# Altium project RouterBatteryLED.PrjPCB
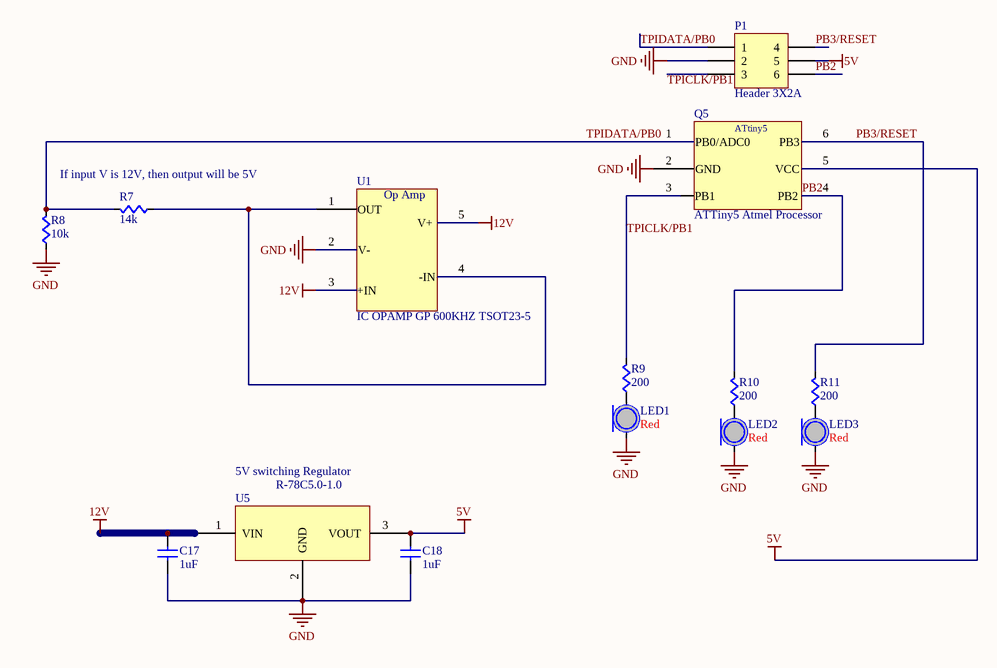
[diagram p0: RouterBatteryLED.SchDoc]
3 sheets, 56 parts. Net scope: global (net labels, ports and power ports of the same name join across sheets).
Board files: Router3.PcbDoc, RouterFinal.PcbDoc
Sheets:
  RouterBatteryLED.SchDoc
  Batteries.SchDoc
  Switching_Regulator.SchDoc

## Sheet RouterBatteryLED.SchDoc
size A

### Parts
C17  value 1uF  [CAPC0603]  (hidden comment: Cap)
C18  value 1uF  [CAPC0603]  (hidden comment: Cap)
LED1  Color: Red  [LED0603]  (hidden comment: LED)
LED2  Color: Red  [LED0603]  (hidden comment: LED)
LED3  Color: Red  [LED0603]  (hidden comment: LED)
P1  Header 3X2A  [HDR2X3_CEN]
Q5  ATTiny5 Atmel Processor  [ATTiny5]
R7  value 14k  [RES0603]  (hidden comment: Res)
R8  value 10k  [RES0603]  (hidden comment: Res)
R9  value 200  [RES0603]  (hidden comment: Res)
R10  value 200  [RES0603]  (hidden comment: Res)
R11  value 200  [RES0603]  (hidden comment: Res)
U1  IC OPAMP GP 600KHZ TSOT23-5  [SOT95P280X100-5N]
U5  R-78C5.0-1.0  [R-78C5.0-1.0]

### Nets
5V: C18.1(A) P1.5 Q5.5(VCC) U5.3(VOUT)
12V: C17.1(A) U1.3(+IN) U1.5(V+) U5.1(VIN)
GND: C17.2(B) C18.2(B) LED1.C LED2.C LED3.C P1.2 R8.2(B) U1.2(V-) U5.2(GND)
PB2: P1.6 Q5.4(PB2) R10.1(A)
PB3/RESET: P1.4 Q5.6(PB3) R11.1(A)
TPICLK/PB1: R9.1(A)
TPIDATA/PB0: P1.1 Q5.1(PB0/ADC0) R7.1(A) R8.1(A)
NetLED1_A: LED1.A R9.2(B)
NetLED2_A: LED2.A R10.2(B)
NetLED3_A: LED3.A R11.2(B)
NetR7_2: R7.2(B) U1.4(-IN)

Not connected (* = marked no-connect by the designer): P1 3; Q5 2(GND) 3(PB1); U1 1(OUT)

### Notes on the sheet
- If input V is 12V, then output will be 5V
- 5V switching Regulator
- Labels drawn without touching a wire or pin: GND, TPICLK/PB1
- (in symbol ATTiny5 Atmel Processor) ATtiny5
- (in symbol IC OPAMP GP 600KHZ TSOT23-5) Op Amp

### Library data of the parts
P1 = Header 3X2A: Header, 3-Pin, Dual row; LatestRevisionDate: 17-Jul-2002; LatestRevisionNote: Re-released for DXP Platform.; Publisher: Altium Limited
Q5 = ATTiny5 Atmel Processor: Manufacturer Part #: ATTINY5-TSHR; DigiKey Part Number: ATTiny5-TSHRCT-ND
U1 = IC OPAMP GP 600KHZ TSOT23-5: Manufacturer Part #: AD8677AUJZ-REEL7; DigiKey Part #: AD8677AUJZ-REEL7CT-ND
U5 = R-78C5.0-1.0: CONV DC/DC 1A 5V OUT SIP VERT; Supplier 1: Digi-Key; Supplier Part Number 1: 945-1395-5-ND
C17 C18 = Cap: Supplier 1: Digi-Key; Supplier Part Number 1: 1276-1860-1-ND
LED1-LED3 = LED: Supplier 1: Digi-Key; Supplier Part Number 1: 754-1122-1-ND
R7-R11 = Res: Supplier 1: Digi-Key; Supplier Part Number 1: RMCF0603JT10K0CT-ND

## Sheet Batteries.SchDoc
size A
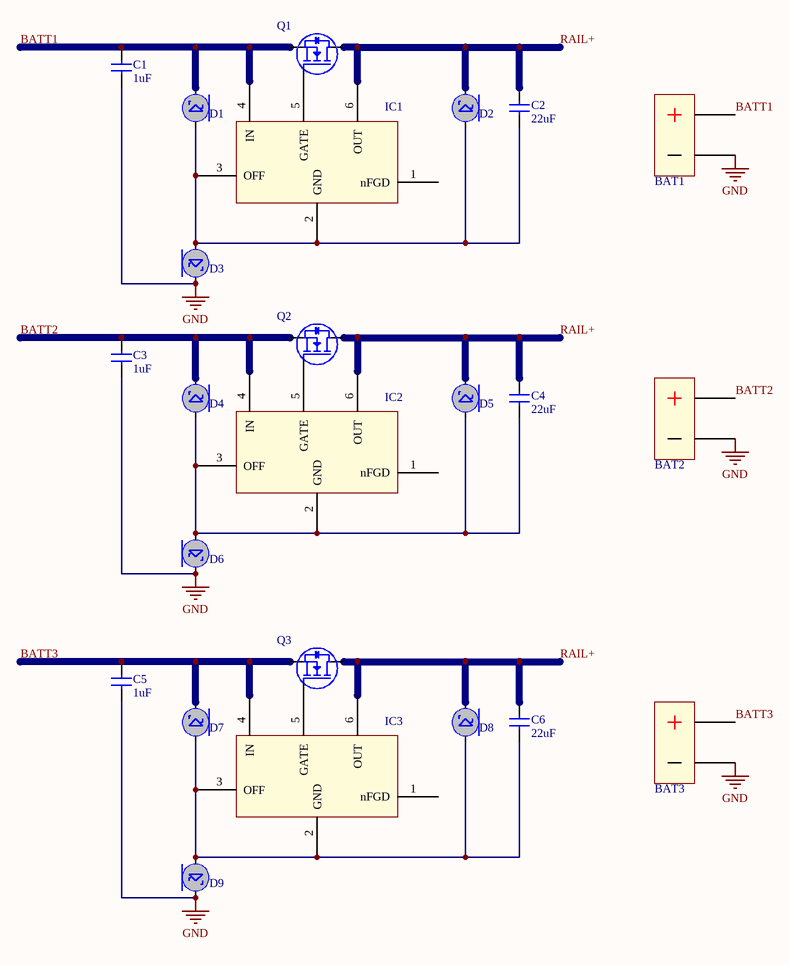
[diagram p1: Batteries.SchDoc]

### Parts
BAT1  BATWIRE  [BATWIRE12]  (value not drawn)
BAT2  BATWIRE  [BATWIRE12]  (value not drawn)
BAT3  BATWIRE  [BATWIRE12]  (value not drawn)
C1  value 1uF  [CAPC0603]  (hidden comment: Cap)
C2  value 22uF  [CAPC0603]  (hidden comment: Cap)
C3  value 1uF  [CAPC0603]  (hidden comment: Cap)
C4  value 22uF  [CAPC0603]  (hidden comment: Cap)
C5  value 1uF  [CAPC0603]  (hidden comment: Cap)
C6  value 22uF  [CAPC0603]  (hidden comment: Cap)
D1  SS16T3G  [SS16T3G]  (value not drawn)
D2  SMBJ100A-13-F  [SMBJ100A-13-F]  (value not drawn)
D3  SS16T3G  [SS16T3G]  (value not drawn)
D4  SS16T3G  [SS16T3G]  (value not drawn)
D5  SMBJ100A-13-F  [SMBJ100A-13-F]  (value not drawn)
D6  SS16T3G  [SS16T3G]  (value not drawn)
D7  SS16T3G  [SS110-TP]  (value not drawn)
D8  SMBJ100A-13-F  [SMBJ100A-13-F]  (value not drawn)
D9  SS16T3G  [SS110-TP]  (value not drawn)
IC1  LM5050MK-2/NOPB  [LM5050MK-2/NOPB]  (value not drawn)
IC2  LM5050MK-2/NOPB  [LM5050MK-2/NOPB]  (value not drawn)
IC3  LM5050MK-2/NOPB  [LM5050MK-2/NOPB]  (value not drawn)
Q1  TPCA8052-H(TE12LQM  [TPCA8052-H(TE12LQM]  (value not drawn)
Q2  TPCA8052-H(TE12LQM  [TPCA8052-H(TE12LQM]  (value not drawn)
Q3  TPCA8052-H(TE12LQM  [TPCA8052-H(TE12LQM]  (value not drawn)

### Nets
GND: BAT1.- BAT2.- BAT3.- C1.2(B) C3.2(B) C5.2(B) D3.C D6.C D9.C
BATT1: BAT1.+ C1.1(A) D1.C IC1.4(IN) Q1.S
BATT2: BAT2.+ C3.1(A) D4.C IC2.4(IN) Q2.S
BATT3: BAT3.+ C5.1(A) D7.C IC3.4(IN) Q3.S
RAIL+: C2.1(A) C4.1(A) C6.1(A) D2.C D5.C D8.C IC1.6(OUT) IC2.6(OUT) IC3.6(OUT) Q1.D Q2.D Q3.D
NetC2_2: C2.2(B) D1.A D2.A D3.A IC1.2(GND) IC1.3(OFF)
NetC4_2: C4.2(B) D4.A D5.A D6.A IC2.2(GND) IC2.3(OFF)
NetC6_2: C6.2(B) D7.A D8.A D9.A IC3.2(GND) IC3.3(OFF)
NetIC1_5: IC1.5(GATE) Q1.G
NetIC2_5: IC2.5(GATE) Q2.G
NetIC3_5: IC3.5(GATE) Q3.G

Not connected (* = marked no-connect by the designer): IC1 1(nFGD); IC2 1(nFGD); IC3 1(nFGD)

### Library data of the parts
BAT1-BAT3 = BATWIRE: Two large gauge leads soldered directly to the board.
D1 D3 D4 D6 D7 D9 = SS16T3G: DIODE SCHOTTKY 60V 1A SMA; Supplier 1: Digi-Key; Supplier Part Number 1: SS110-TPDKR-ND
D2 D5 D8 = SMBJ100A-13-F: TVS DIODE 100VWM 162VC SMB; Supplier 1: Digi-Key; Supplier Part Number 1: SMBJ100A-FDIDKR-ND
IC1-IC3 = LM5050MK-2/NOPB: IC OR CTRLR N+1 6SOT; Supplier 1: Digi-Key; Supplier Part Number 1: LM5050MK-2/NOPBDKR-ND
Q1-Q3 = TPCA8052-H: MOSFET N-CH 40V 20A 8SOP; Supplier 1: Digi-Key; Supplier Part Number 1: TPCA8052-H(TE12LQMDKR-ND
C1-C6 = Cap: Supplier 1: Digi-Key; Supplier Part Number 1: 1276-1000-1-ND

## Sheet Switching_Regulator.SchDoc
size A
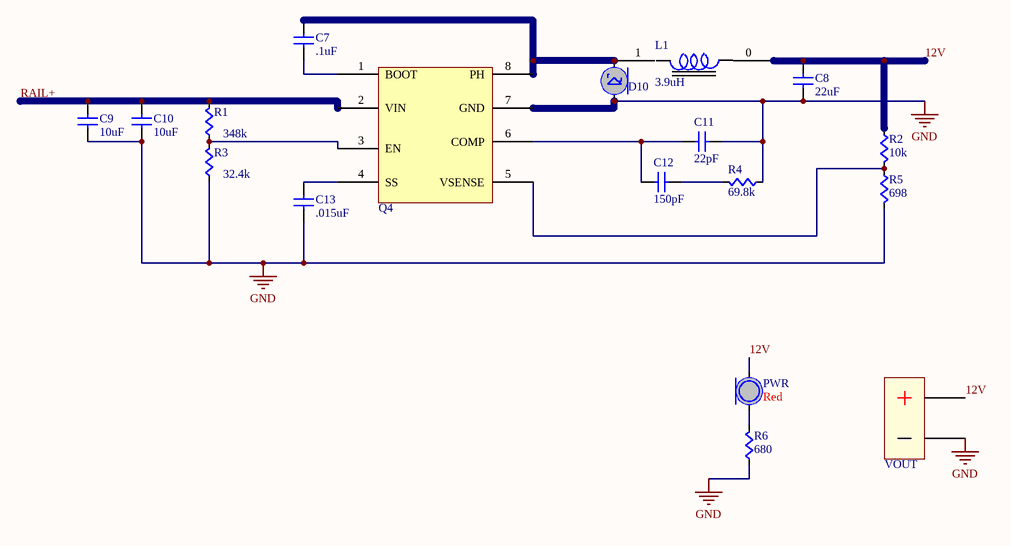
[diagram p2: Switching_Regulator.SchDoc]

### Parts
C7  value .1uF  [CAPC0603]  (hidden comment: Cap)
C8  value 22uF  [CAPC1206]  (hidden comment: Cap)
C9  value 10uF  [CAPC0603]  (hidden comment: Cap)
C10  value 10uF  [CAPC0603]  (hidden comment: Cap)
C11  value 22pF  [CAPC0603]  (hidden comment: Cap)
C12  value 150pF  [CAPC0603]  (hidden comment: Cap)
C13  value .015uF  [CAPC0603]  (hidden comment: Cap)
D10  DFLS160  [RSX501L-20TE25]  (value not drawn)
L1  37392C  [37392C]  (value not drawn)
PWR  Color: Red  [LED0603]  (hidden comment: LED)
Q4  TPS54332DDA  [TPS54332DDA]  (value not drawn)
R1  value 348k  [RES0603]  (hidden comment: Res)
R2  value 10k  [RES0603]  (hidden comment: Res)
R3  value 32.4k  [RES0603]  (hidden comment: Res)
R4  value 69.8k  [RES0603]  (hidden comment: Res)
R5  value 698  [RES0603]  (hidden comment: Res)
R6  value 680  [RES0603]  (hidden comment: Res)
VOUT  BATWIRE  [BATWIRE12]  (value not drawn)

### Nets
12V: C8.1(A) L1.0 PWR.A R2.2(B) VOUT.+
GND: C8.2(B) C9.2(B) C10.2(B) C11.2(B) C13.2(B) D10.A Q4.7(GND) R3.2(B) R4.2(B) R5.1(A) R6.2(B) VOUT.-
RAIL+: C9.1(A) C10.1(A) Q4.2(VIN) R1.1(A)
NetC7_1: C7.1(A) D10.C L1.1 Q4.8(PH)
NetC7_2: C7.2(B) Q4.1(BOOT)
NetC11_1: C11.1(A) C12.1(A) Q4.6(COMP)
NetC12_2: C12.2(B) R4.1(A)
NetC13_1: C13.1(A) Q4.4(SS)
NetPWR_C: PWR.C R6.1(A)
NetQ4_3: Q4.3(EN) R1.2(B) R3.1(A)
NetQ4_5: Q4.5(VSENSE) R2.1(A) R5.2(B)

### Notes on the sheet
- (in symbol 37392C) 3.9uH

### Library data of the parts
D10 = DFLS160: 1.0A Surface Mount Schottky Barrier Rectifier; Supplier 1: Digi-Key; Supplier Part Number 1: RSX501L-20TE25DKR-ND
L1 = 37392C: INDUCTOR 3.90UH 10.0A SMD; Supplier 1: Digi-Key; Supplier Part Number 1: 811-2518-1-ND
Q4 = TPS54332DDA: IC REG BUCK ADJ 3.5A 8SOPWRPAD; Supplier 1: Digi-Key; Supplier Part Number 1: 296-24141-5-ND
VOUT = BATWIRE: as BAT1 on sheet Batteries
C7-C13 = Cap: Supplier 1: Digi-Key
  C7: Supplier Part Number 1: 1276-1000-1-ND
  C8: Supplier Part Number 1: 1276-2725-1-ND
  C9 C10: Supplier Part Number 1: 1276-1869-6-ND
  C11: Supplier Part Number 1: 445-1273-1-ND
  C12: Supplier Part Number 1: 399-1063-1-ND
  C13: Supplier Part Number 1: 1276-1277-6-ND
PWR = LED: Supplier 1: Digi-Key; Supplier Part Number 1: 754-1122-1-ND
R1-R6 = Res: Supplier 1: Digi-Key
  R1: Supplier Part Number 1: RMCF0603FT348KCT-ND
  R2: Supplier Part Number 1: RMCF0603FT10K0CT-ND
  R3: Supplier Part Number 1: P32.4KHCT-ND
  R4: Supplier Part Number 1: RMCF0603FT69K8CT-ND
  R5: Supplier Part Number 1: RMCF0603FT698RDKR-ND
  R6: Supplier Part Number 1: RMCF0603JT10K0CT-ND

## Nets that join several sheets
12V: RouterBatteryLED (C17.1 U1.3 U1.5 U5.1), Switching_Regulator (5 pins)
GND: RouterBatteryLED (9 pins), Batteries (9 pins), Switching_Regulator (12 pins)
RAIL+: Batteries (12 pins), Switching_Regulator (C9.1 C10.1 Q4.2 R1.1)